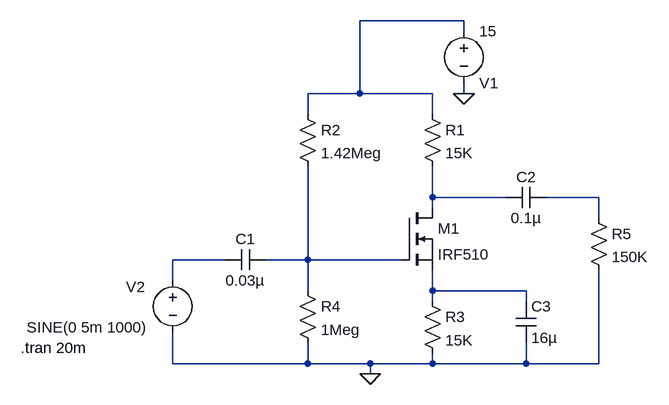
[diagram p0: schematic CURRENT SERIES FEEDBACK MOSFET AMPLIFIER.asc]
CURRENT SERIES FEEDBACK MOSFET AMPLIFIER.asc, the LTspice schematic file:
Version 4
SHEET 1 1016 680
WIRE 272 -160 112 -160
WIRE 272 -144 272 -160
WIRE 112 -48 112 -160
WIRE 112 -48 32 -48
WIRE 224 -48 112 -48
WIRE 272 -48 272 -64
WIRE 32 -16 32 -48
WIRE 224 -16 224 -48
WIRE 224 112 224 64
WIRE 336 112 224 112
WIRE 480 112 400 112
WIRE 224 128 224 112
WIRE 480 144 480 112
WIRE -96 208 -176 208
WIRE 32 208 32 64
WIRE 32 208 -32 208
WIRE 176 208 32 208
WIRE -176 240 -176 208
WIRE 32 256 32 208
WIRE 224 256 224 224
WIRE 368 256 224 256
WIRE 224 272 224 256
WIRE 368 272 368 256
WIRE -176 368 -176 320
WIRE 32 368 32 336
WIRE 32 368 -176 368
WIRE 128 368 32 368
WIRE 224 368 224 352
WIRE 224 368 128 368
WIRE 368 368 368 336
WIRE 368 368 224 368
WIRE 480 368 480 224
WIRE 480 368 368 368
WIRE 128 384 128 368
FLAG 272 -48 0
FLAG 128 384 0
SYMBOL nmos 176 128 R0
SYMATTR InstName M1
SYMATTR Value IRF510
SYMBOL res 16 -32 R0
SYMATTR InstName R2
SYMATTR Value 1.42Meg
SYMBOL cap -32 192 R90
WINDOW 0 0 32 VBottom 2
WINDOW 3 32 32 VTop 2
SYMATTR InstName C1
SYMATTR Value 0.03µ
SYMBOL res 208 -32 R0
SYMATTR InstName R1
SYMATTR Value 15K
SYMBOL res 208 256 R0
SYMATTR InstName R3
SYMATTR Value 15K
SYMBOL res 16 240 R0
SYMATTR InstName R4
SYMATTR Value 1Meg
SYMBOL voltage 272 -160 R0
WINDOW 0 24 96 Left 2
WINDOW 3 24 16 Left 2
WINDOW 123 0 0 Left 0
WINDOW 39 0 0 Left 0
SYMATTR InstName V1
SYMATTR Value 15
SYMBOL cap 400 96 R90
WINDOW 0 0 32 VBottom 2
WINDOW 3 32 32 VTop 2
SYMATTR InstName C2
SYMATTR Value 0.1µ
SYMBOL res 464 128 R0
SYMATTR InstName R5
SYMATTR Value 150K
SYMBOL cap 352 272 R0
SYMATTR InstName C3
SYMATTR Value 16µ
SYMBOL voltage -176 224 R0
WINDOW 0 -72 26 Left 2
WINDOW 3 -225 88 Left 2
WINDOW 123 0 0 Left 0
WINDOW 39 0 0 Left 0
SYMATTR InstName V2
SYMATTR Value SINE(0 5m 1000)
TEXT -410 344 Left 2 !.tran 20m

The netlist it stands for:
* CURRENT SERIES FEEDBACK MOSFET AMPLIFIER.asc
M1 N002 N005 N006 N006 IRF510
R2 N001 N005 1.42Meg
C1 N005 N004 0.03µ
R1 N001 N002 15K
R3 N006 0 15K
R4 N005 0 1Meg
V1 N001 0 15
C2 N003 N002 0.1µ
R5 N003 0 150K
C3 N006 0 16µ
V2 N004 0 SINE(0 5m 1000)
.model NMOS NMOS
.model PMOS PMOS
.lib standard.mos
.tran 20m
.backanno
.end